# Altium project Power_Amplifier.PrjPcb
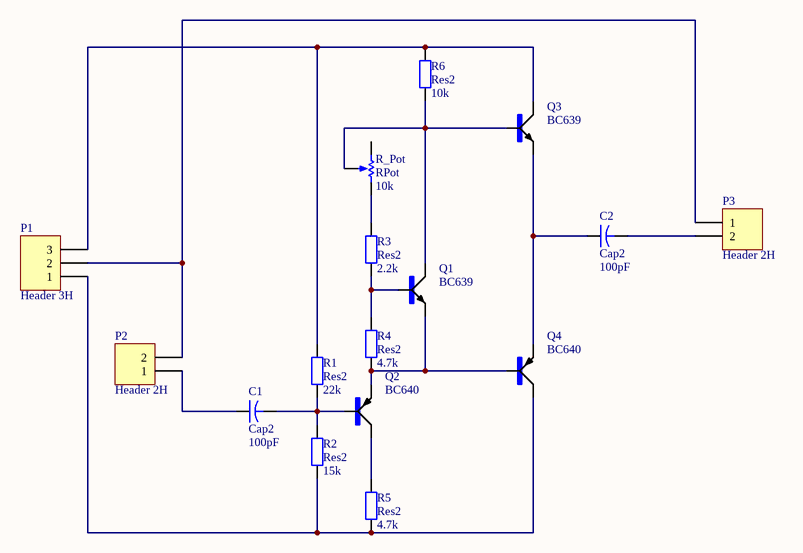
[diagram p0: Amp_2.SchDoc]
1 sheet, 16 parts. Net scope: global (net labels, ports and power ports of the same name join across sheets).
Board files: Amp__22.PcbDoc, amp_33.PcbDoc

## Sheet Amp_2.SchDoc
size A

### Parts
C1  Cap2  value 100pF  [CAPR5-4X5]
C2  Cap2  value 100pF  [CAPR5-4X5]
P1  Header 3H  [HDR1X3H]
P2  Header 2H  [HDR1X2H]
P3  Header 2H  [HDR1X2H]
Q1  BC639  [*SOT54D_BC639(Primary)]
Q2  BC640  [*SOT54D_BC640(Primary)]
Q3  BC639  [*SOT54D_BC639(Primary)]
Q4  BC640  [*SOT54D_BC640(Primary)]
R1  Res2  value 22k  [AXIAL-0.4]
R2  Res2  value 15k  [AXIAL-0.4]
R3  Res2  value 2.2k  [AXIAL-0.4]
R4  Res2  value 4.7k  [AXIAL-0.4]
R5  Res2  value 4.7k  [AXIAL-0.4]
R6  Res2  value 10k  [AXIAL-0.4]
R_Pot  RPot  value 10k  [VR5]

### Nets
NetC1_1: C1.1 P2.1
NetC1_2: C1.2 Q2.B R1.1 R2.2
NetC2_1: C2.1 Q3.E Q4.E
NetC2_2: C2.2 P3.2
NetP1_1: P1.1 Q4.C R2.1 R5.1
NetP1_2: P1.2 P2.2 P3.1
NetP1_3: P1.3 Q3.C R1.2 R6.2
NetQ1_B: Q1.B R3.1 R4.2
NetQ1_C: Q1.C Q3.B R6.1 R_Pot.3(TAP)
NetQ1_E: Q1.E Q2.E Q4.B R4.1
NetQ2_C: Q2.C R5.2
NetR3_2: R3.2 R_Pot.2(BOT)

Not connected (* = marked no-connect by the designer): R_Pot 1(TOP)

### Library data of the parts
C1 C2 = Cap2: Capacitor; Published: 23-Sep-2002; PackageReference: CAPR5-4X5; Publisher: Altium Limited; PackageDescription: Capacitor; 2 Leads
P1 = Header 3H: Header, 3-Pin, Right Angle; LatestRevisionDate: 17-Jul-2002; LatestRevisionNote: Re-released for DXP Platform.; Publisher: Altium Limited
P2 P3 = Header 2H: Header, 2-Pin, Right Angle; LatestRevisionDate: 17-Jul-2002; LatestRevisionNote: Re-released for DXP Platform.; Publisher: Altium Limited
Q1 Q3 = BC639: Bipolar _BJT_ Transistor NPN 80V 1A 200MHz 625mW Through Hole TO-92-3; MF: ON Semiconductor; SnapEDA_Link: https://www.snapeda.com/parts/BC639/ON%20Semiconductor/view-part/761111/?ref=snap; Price: None; MP: BC639; Package: TO-92 Continental Device; Availability: Unavailable; Value: *
Q2 Q4 = BC640: Bipolar _BJT_ Transistor PNP 80V 500mA 150MHz 625mW Through Hole TO-92-3; MF: ON Semiconductor; SnapEDA_Link: https://www.snapeda.com/parts/BC640/ON%20Semiconductor/view-part/2782146/?ref=snap; Price: None; MP: BC640; Package: TO-92 Continental Device; Availability: Unavailable; Value: *
R1-R6 = Res2: Resistor; Published: 8-Jun-2000; LatestRevisionDate: 17-Jul-2002; LatestRevisionNote: Re-released for DXP Platform.; PackageReference: AXIAL-0.4; Publisher: Altium Limited; PackageDescription: Axial Device, Thru-Hole; 2 Leads; 0.4 in Pin Spacing
R_Pot = RPot: Potentiometer; Sim Note: Enter the Resistance value and the set point into parameter fields.; Set Position: 0.5; Published: 8-Jun-2000; LatestRevisionDate: 17-Jul-2002; LatestRevisionNote: Re-released for DXP Platform.; PackageReference: VR5; Publisher: Altium Limited; PackageDescription: Variable Resistor, Thru-Hole; 3 Leads